# Altium project hw_design.PrjPcb (part 3 of 5)

## Sheet comms_vhf.SchDoc
size A4; SheetNumber: 3; SheetTotal: 5
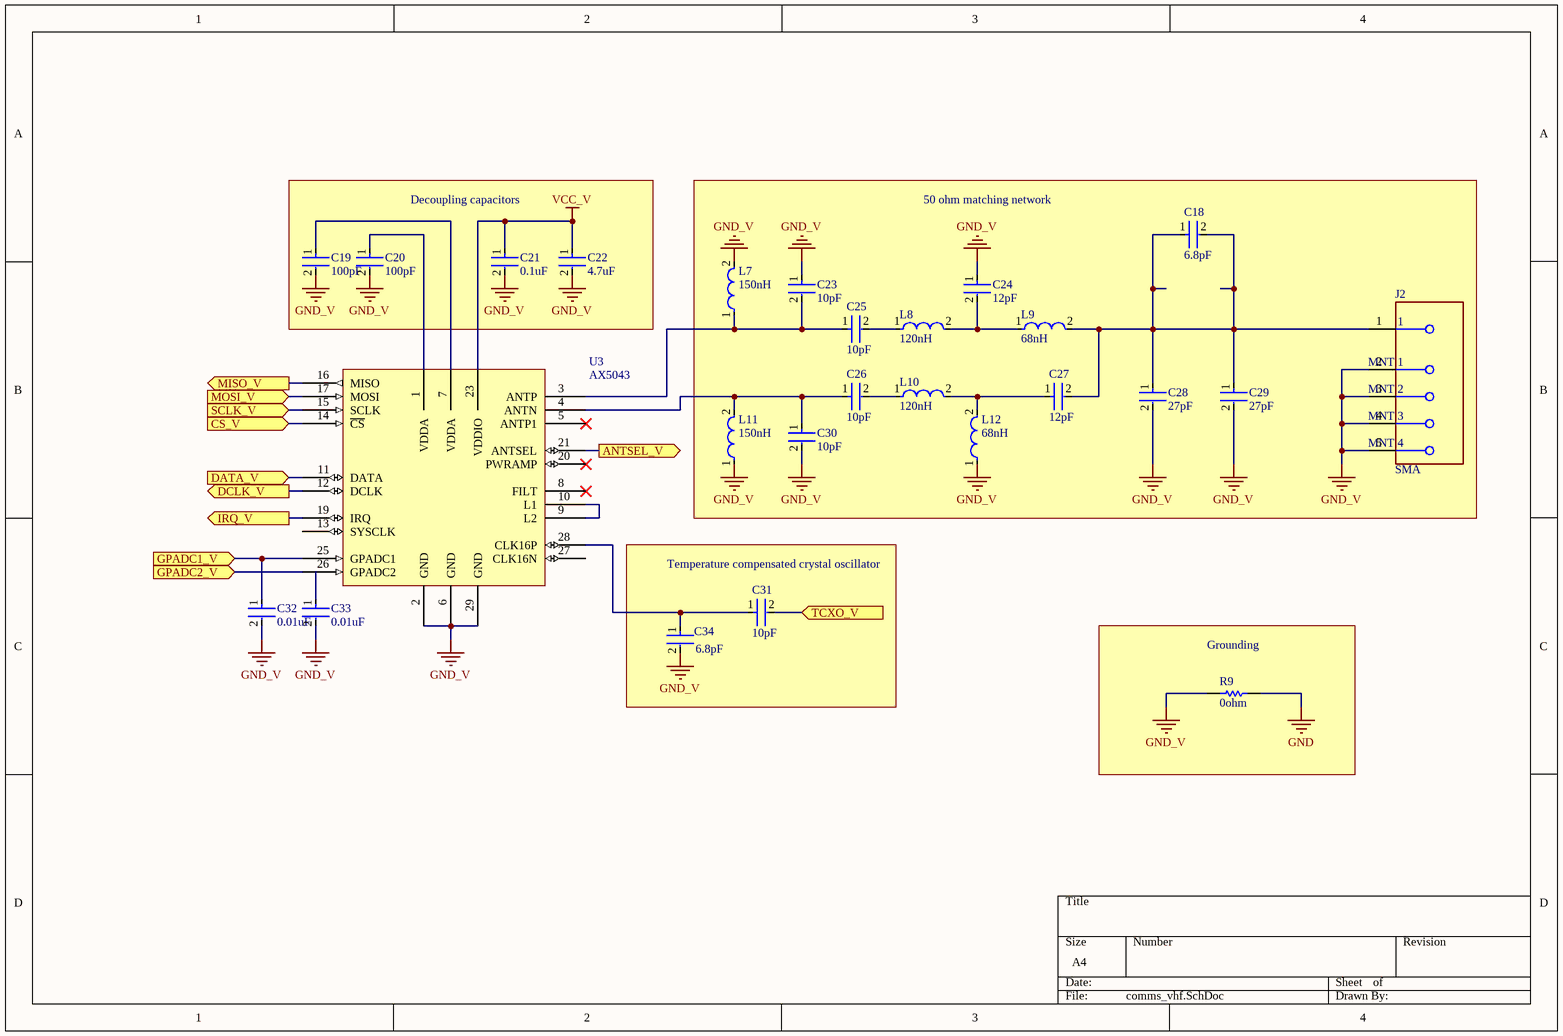
[diagram p2: comms_vhf.SchDoc]

### Parts
C18  6.8pF  [FP-C0805C-DN-IPC_A]
C19  100pF  [FP-C0805C-DN-IPC_A]
C20  100pF  [FP-C0805C-DN-IPC_A]
C21  0.1uF  [FP-C0805C-DN-IPC_A]
C22  4.7uF  [FP-C0805C-DN-IPC_A]
C23  10pF  [FP-C0805C-DN-IPC_A]
C24  12pF  [FP-C0805C-DN-IPC_A]
C25  10pF  [FP-C0805C-DN-IPC_A]
C26  10pF  [FP-C0805C-DN-IPC_A]
C27  12pF  [FP-C0805C-DN-IPC_A]
C28  27pF  [FP-C0805C-DN-IPC_A]
C29  27pF  [FP-C0805C-DN-IPC_A]
C30  10pF  [FP-C0805C-DN-IPC_A]
C31  10pF  [FP-C0805C-DN-IPC_A]
C32  0.01uF  [FP-C0805C-DN-IPC_A]
C33  0.01uF  [FP-C0805C-DN-IPC_A]
C34  6.8pF  [FP-C0805C-DN-IPC_A]
J2  SMA  [FP-73251-1350-MFG]
L7  150nH  [FP-C0805C-DN-IPC_A]
L8  120nH  [FP-C0805C-DN-IPC_A]
L9  68nH  [FP-C0805C-DN-IPC_A]
L10  120nH  [FP-C0805C-DN-IPC_A]
L11  150nH  [FP-C0805C-DN-IPC_A]
L12  68nH  [FP-C0805C-DN-IPC_A]
R9  0ohm  [FP-C0805C-DN-IPC_A]
U3  AX5043  [QFN50P500X500X90_HS-29N]

### Blocks framed on the sheet
Decoupling capacitors: C19-C22
50 ohm matching network: C18 C23-C30 J2 L7-L12
Temperature compensated crystal oscillator: C31 C34
Grounding: R9

### Ports
ANTSEL_V (out), CS_V (in), DATA_V (in), DCLK_V (out), GPADC1_V (in), GPADC2_V (in), IRQ_V (out), MISO_V (out), MOSI_V (in), SCLK_V (in), TCXO_V (in)

### Nets
GND: R9.2
GND_V: C19.2 C20.2 C21.2 C22.2 C23.1 C24.1 C28.2 C29.2 C30.2 C32.2 C33.2 C34.2 J2.2(MNT_1) J2.3(MNT_2) J2.4(MNT_3) J2.5(MNT_4) L7.2 L11.1 L12.1 R9.1 U3.2(GND) U3.6(GND) U3.29(GND)
VCC_V: C21.1 C22.1 U3.23(VDDIO)
ANTSEL_V: U3.21(ANTSEL) ; port ANTSEL_V
CS_V: U3.14(~{CS}) ; port CS_V
DATA_V: U3.11(DATA) ; port DATA_V
DCLK_V: U3.12(DCLK) ; port DCLK_V
GPADC1_V: C32.1 U3.25(GPADC1) ; port GPADC1_V
GPADC2_V: U3.26(GPADC2) ; port GPADC2_V
IRQ_V: U3.19(IRQ) ; port IRQ_V
MISO_V: U3.16(MISO) ; port MISO_V
MOSI_V: U3.17(MOSI) ; port MOSI_V
SCLK_V: U3.15(SCLK) ; port SCLK_V
TCXO_V: C31.2 ; port TCXO_V
NetC18_1: C18.1 C18.2 C27.2 C28.1 C29.1 J2.1 L9.2
NetC19_1: C19.1 U3.7(VDDA)
NetC20_1: C20.1 U3.1(VDDA)
NetC23_2: C23.2 C25.1 L7.1 U3.3(ANTP)
NetC24_2: C24.2 L8.2 L9.1
NetC25_2: C25.2 L8.1
NetC26_1: C26.1 C30.1 L11.2 U3.4(ANTN)
NetC26_2: C26.2 L10.1
NetC27_1: C27.1 L10.2 L12.2
NetC31_1: C31.1 C34.1 U3.28(CLK16P)
NetU3_9: U3.9(L2) U3.10(L1)

Not connected (* = marked no-connect by the designer): C33 1; U3 5(ANTP1)* 8(FILT)* 13(SYSCLK) 20(PWRAMP)* 27(CLK16N)

### Library data of the parts
C18 C34 = C0805C689D5GACTU: Cap Ceramic 6.8pF 50V C0G 0.5pF SMD 0805 125°C Plastic T/R; Manufacturer: KEMET; Dissipation Factor: 0.1%; Supplier 1: Digi-Key; Manufacturer Part Number: C0805C689D5GACTU; RoHS: Yes; Category: Ceramic Capacitors; Stock 1: 43898; Pricing 1: 1=0.24000, 10=0.16500, 50=0.11000, 100=0.09350, 500=0.06600, 1000=0.05775 (USD); Mount: Surface Mount; Case/Package: 0805; Case Code (Metric): 2012; Case Code (Imperial): 0805; Dielectric Material: Ceramic; Contact Material: Tin; Min Operating Temperature: -55°C; Max Operating Temperature: 125°C; Package Quantity: 1; Capacitance: 6.8pF; Voltage Rating: 50V; Packaging: Tape and Reel; Voltage Rating (DC): 50V; Termination: SMD/SMT; Series: C; Dielectric: C0G; Construction: Flat; Length: 2mm; Width: 0.049inch; Height: 0.78mm; Thickness: 0.035inch; Depth: 1.25mm; Lead Pitch: 0.75mm; Radiation Hardening: No; RoHS Compliant: Yes; Lead Free: Lead Free; REACH SVHC: No SVHC; ComponentLink1URL: https://www.distrelec.biz/Web/Downloads/_t/ds/KEM_C1003_C0G_SMD_eng_tds.pdf?mime=application%2Fpdf&src-supplier=Distrelec; ComponentLink1Description: https://www.distrelec.biz/Web/Downloads/_t/ds/KEM_C1003_C0G_SMD_eng_tds.pdf?mime=application%2Fpdf&src-supplier=Distrelec; ComponentLink2URL: http://www.farnell.com/datasheets/2330629.pdf?src-supplier=Farnell; ComponentLink2Description: http://www.farnell.com/datasheets/2330629.pdf?src-supplier=Farnell; ComponentLink3URL: http://www.mouser.com/ds/2/212/KEM_C1003_C0G_SMD-1101588.pdf?src-supplier=Mouser; ComponentLink3Description: http://www.mouser.com/ds/2/212/KEM_C1003_C0G_SMD-1101588.pdf?src-supplier=Mouser; ComponentLink4URL: http://www.farnell.com/datasheets/2330629.pdf?src-supplier=Newark; ComponentLink4Description: http://www.farnell.com/datasheets/2330629.pdf?src-supplier=Newark; ComponentLink5URL: https://api.kemet.com/component-edge/download/datasheet/C0805C689D5GACTU.pdf?src-supplier=Digi-Key; ComponentLink5Description: https://api.kemet.com/component-edge/download/datasheet/C0805C689D5GACTU.pdf?src-supplier=Digi-Key; ComponentLink6URL: https://search.kemet.com/component-edge/download/datasheet/C0805C689D5GACTU.pdf?src-supplier=Digi-Key; ComponentLink6Description: https://search.kemet.com/component-edge/download/datasheet/C0805C689D5GACTU.pdf?src-supplier=Digi-Key; Supplier Part Number 1: 399-C0805C689D5GAC7800CT-ND
C19 C20 = C0805C101J1GACTU: Multilayer Ceramic Capacitors (MLCC) - SMD/SMT 100volts 100pF C0G 5%; Manufacturer: KEMET; Voltage Rating: 100V; Temperature Coefficient: 30ppm/°C; Dissipation Factor: 0.1%; Supplier 1: Digi-Key; Manufacturer Part Number: C0805C101J1GACTU; RoHS: Yes; Category: Ceramic Capacitors; Stock 1: 41207; Pricing 1: 1=0.11000, 10=0.07900, 50=0.04500, 100=0.03730, 500=0.02616, 1000=0.02166 (USD); Mount: Surface Mount,PCB; Case/Package: 0805; Number of Pins: 2; Case Code (Imperial): 0805; Case Code (Metric): 2012; Contact Plating: Tin,Matte; Dielectric Material: Ceramic; Contact Material: Tin; Min Operating Temperature: -55°C; Max Operating Temperature: 125°C; Capacitance: 100pF; Tolerance: 5%; Voltage Rating (DC): 100V; Packaging: Tape and Reel; Dielectric: C0G; Series: C; Package Quantity: 1; Termination: SMD/SMT; Voltage: 100V; Construction: Flat; Length: 2mm; Width: 1.2mm; Height: 0.78mm; Thickness: 0.035inch; Depth: 1.25mm; Lead Pitch: 0.75mm; Radiation Hardening: No; Lead Free: Lead Free; RoHS Compliant: Yes; REACH SVHC: No SVHC; ComponentLink1URL: https://datasheet.ciiva.com/144/docfinderpartnumber-c0805c101j1gactu-144890.pdf?src-supplier=Digi-Key; ComponentLink1Description: https://datasheet.ciiva.com/144/docfinderpartnumber-c0805c101j1gactu-144890.pdf?src-supplier=Digi-Key; ComponentLink2URL: https://datasheet.ciiva.com/6126/f9080b-0402-series-c0g-6126695.pdf?src-supplier=Farnell; ComponentLink2Description: https://datasheet.ciiva.com/6126/f9080b-0402-series-c0g-6126695.pdf?src-supplier=Farnell; ComponentLink3URL: https://datasheet.ciiva.com/2988/kem-c1003-c0g-smd-2988557.pdf?src-supplier=Avnet; ComponentLink3Description: https://datasheet.ciiva.com/2988/kem-c1003-c0g-smd-2988557.pdf?src-supplier=Avnet; ComponentLink4URL: https://datasheet.ciiva.com/2988/kem-c1003-c0g-smd-2988558.pdf?src-supplier=Avnet; ComponentLink4Description: https://datasheet.ciiva.com/2988/kem-c1003-c0g-smd-2988558.pdf?src-supplier=Avnet; ComponentLink5URL: https://datasheet.ciiva.com/14589/70095383-14589484.pdf?src-supplier=Allied+Electronics; ComponentLink5Description: https://datasheet.ciiva.com/14589/70095383-14589484.pdf?src-supplier=Allied+Electronics; ComponentLink6URL: https://datasheet.ciiva.com/14591/70095383-14591851.pdf?src-supplier=Allied+Electronics; ComponentLink6Description: https://datasheet.ciiva.com/14591/70095383-14591851.pdf?src-supplier=Allied+Electronics; ComponentLink7URL: https://datasheet.ciiva.com/7842/40889-7842143.pdf?src-supplier=Element14; ComponentLink7Description: https://datasheet.ciiva.com/7842/40889-7842143.pdf?src-supplier=Element14; ComponentLink8URL: https://datasheet.ciiva.com/28688/1789732-28688663.pdf?src-supplier=Element14; ComponentLink8Description: https://datasheet.ciiva.com/28688/1789732-28688663.pdf?src-supplier=Element14; ComponentLink9URL: https://datasheet.ciiva.com/18193/getdatasheetpartid-93983-18193285.pdf?src-supplier=Verical; ComponentLink9Description: https://datasheet.ciiva.com/18193/getdatasheetpartid-93983-18193285.pdf?src-supplier=Verical; ComponentLink10URL: https://datasheet.ciiva.com/7405/1372242-7405224.pdf?src-supplier=Newark; ComponentLink10Description: https://datasheet.ciiva.com/7405/1372242-7405224.pdf?src-supplier=Newark; Supplier Part Number 1: 399-C0805C101J1GAC7800CT-ND
C21 = C0805C104K5RACTU: Cap Ceramic 0.1uF 50V X7R 10% SMD 2.0 x 1.2 mm 125 C Paper T/R; Manufacturer: KEMET; Capacitance: 100nF; Voltage: 500V; Supplier 1: Digi-Key; Manufacturer Part Number: C0805C104K5RACTU; RoHS: Yes; Category: Ceramic Capacitors; Pricing 1: 1=0.15000, 10=0.10500, 50=0.05960, 100=0.04940, 500=0.03466, 1000=0.02869 (USD); Mount: Surface Mount,PCB; Case/Package: 0805; Number of Pins: 2; Case Code (Imperial): 0805; Case Code (Metric): 2012; Dielectric Material: Ceramic; Contact Plating: Tin,Matte; Min Operating Temperature: -55°C; Max Operating Temperature: 125°C; Package Quantity: 4000; Voltage Rating: 50V; Tolerance: 10%; Packaging: Tape and Reel; Dielectric: X7R; Termination: SMD/SMT; Voltage Rating (DC): 50V; Series: C0805C; Construction: Flat; Length: 2mm; Width: 1.2mm; Height: 0.9mm; Thickness: 0.035inch; Depth: 1.25mm; Lead Pitch: 0.75mm; Radiation Hardening: No; REACH SVHC: No SVHC; RoHS Compliant: Yes; ComponentLink1URL: https://www.distrelec.biz/Web/Downloads/_t/ds/KEM_C1002_X7R_SMD_eng_tds.pdf?mime=application%2Fpdf&src-supplier=Distrelec; ComponentLink1Description: https://www.distrelec.biz/Web/Downloads/_t/ds/KEM_C1002_X7R_SMD_eng_tds.pdf?mime=application%2Fpdf&src-supplier=Distrelec; ComponentLink2URL: http://www.farnell.com/datasheets/2740684.pdf?src-supplier=Farnell; ComponentLink2Description: http://www.farnell.com/datasheets/2740684.pdf?src-supplier=Farnell; ComponentLink3URL: http://www.farnell.com/datasheets/2740684.pdf?src-supplier=Element14; ComponentLink3Description: http://www.farnell.com/datasheets/2740684.pdf?src-supplier=Element14; Supplier Part Number 1: 399-C0805C104K5RAC7800CT-ND; Stock 1: 2034176
C22 = C0805C475K3PACTU: Cap Ceramic 4.7uF 25V X5R 10% SMD 0805 85°C Plastic T/R; Manufacturer: KEMET; Dissipation Factor: 5%; Supplier 1: Digi-Key; Manufacturer Part Number: C0805C475K3PACTU; RoHS: Yes; Category: Ceramic Capacitors; Pricing 1: 1=0.36000, 10=0.24800, 50=0.16500, 100=0.14020, 500=0.09900, 1000=0.08662 (USD); Mount: PCB,Surface Mount; Case/Package: 0805; Number of Pins: 2; Case Code (Imperial): 0805; Case Code (Metric): 2012; Dielectric Material: Ceramic; Contact Plating: Tin,Matte; Min Operating Temperature: -55°C; Max Operating Temperature: 85°C; Capacitance: 4.7uF; Tolerance: 10%; Packaging: Tape and Reel; Dielectric: X5R; Package Quantity: 2500; Series: C0805C; Termination: SMD/SMT; Voltage Rating (DC): 25V; Construction: Flat; Voltage: 25V; Length: 2mm; Width: 1.2mm; Height: 1.25mm; Depth: 1.25mm; Radiation Hardening: No; RoHS Compliant: Yes; Lead Free: Lead Free; REACH SVHC: No SVHC; ComponentLink1URL: https://datasheet.ciiva.com/3776/c0603c102k5racturegion-naregion-na-3776917.pdf?src-supplier=Arrow+Electronics; ComponentLink1Description: https://datasheet.ciiva.com/3776/c0603c102k5racturegion-naregion-na-3776917.pdf?src-supplier=Arrow+Electronics; ComponentLink2URL: https://datasheet.ciiva.com/18193/getdatasheetpartid-385757-18193895.pdf?src-supplier=Verical; ComponentLink2Description: https://datasheet.ciiva.com/18193/getdatasheetpartid-385757-18193895.pdf?src-supplier=Verical; ComponentLink3URL: https://datasheet.ciiva.com/18193/getdatasheetpartid-195812-18193898.pdf?src-supplier=Verical; ComponentLink3Description: https://datasheet.ciiva.com/18193/getdatasheetpartid-195812-18193898.pdf?src-supplier=Verical; ComponentLink4URL: https://datasheet.ciiva.com/7842/40889-7842614.pdf?src-supplier=Element14; ComponentLink4Description: https://datasheet.ciiva.com/7842/40889-7842614.pdf?src-supplier=Element14; ComponentLink5URL: https://datasheet.ciiva.com/22748/1918694-22748309.pdf?src-supplier=Element14; ComponentLink5Description: https://datasheet.ciiva.com/22748/1918694-22748309.pdf?src-supplier=Element14; Supplier Part Number 1: 399-C0805C475K3PAC7800CT-ND; Stock 1: 10860
C23 C25 C26 C30 C31 = C0805C100J1GACTU: Cap Ceramic 10pF 100V C0G 5% SMD 0805 125C Plastic T/R; Manufacturer: KEMET; Dissipation Factor: 0.1%; Temperature Coefficient: 30ppm/°C; Supplier 1: Digi-Key; Manufacturer Part Number: C0805C100J1GACTU; RoHS: Yes; Category: Ceramic Capacitors; Stock 1: 26087; Pricing 1: 1=0.20000, 10=0.14000, 50=0.07960, 100=0.06600, 500=0.04630, 1000=0.03833 (USD); Mount: Surface Mount,PCB; Case/Package: 0805; Number of Pins: 2; Case Code (Metric): 2012; Case Code (Imperial): 0805; Dielectric Material: Ceramic; Weight: 0.000194oz; Contact Material: Tin; Min Operating Temperature: -55°C; Max Operating Temperature: 125°C; Capacitance: 10pF; Packaging: Tape and Reel; Voltage Rating: 100V; Voltage Rating (DC): 100V; Package Quantity: 1; Dielectric: C0G; Termination: SMD/SMT; Tolerance: 5%; Series: C; Construction: Flat; Voltage: 100V; Length: 2mm; Width: 0.049inch; Height: 0.78mm; Thickness: 0.035inch; Depth: 1.25mm; Radiation Hardening: No; REACH SVHC: No SVHC; RoHS Compliant: Yes; Lead Free: Lead Free; ComponentLink1URL: https://datasheet.ciiva.com/7842/kem-c1003-c0g-smd-7842137.pdf?src-supplier=Element14; ComponentLink1Description: https://datasheet.ciiva.com/7842/kem-c1003-c0g-smd-7842137.pdf?src-supplier=Element14; ComponentLink2URL: https://datasheet.ciiva.com/7842/kem-c1003-c0g-smd-7842136.pdf?src-supplier=Element14; ComponentLink2Description: https://datasheet.ciiva.com/7842/kem-c1003-c0g-smd-7842136.pdf?src-supplier=Element14; ComponentLink3URL: https://datasheet.ciiva.com/28668/1789732-28668725.pdf?src-supplier=Element14; ComponentLink3Description: https://datasheet.ciiva.com/28668/1789732-28668725.pdf?src-supplier=Element14; ComponentLink4URL: https://datasheet.ciiva.com/14588/70095383-14588189.pdf?src-supplier=Allied+Electronics; ComponentLink4Description: https://datasheet.ciiva.com/14588/70095383-14588189.pdf?src-supplier=Allied+Electronics; ComponentLink5URL: https://datasheet.ciiva.com/14603/70095383-14603133.pdf?src-supplier=Allied+Electronics; ComponentLink5Description: https://datasheet.ciiva.com/14603/70095383-14603133.pdf?src-supplier=Allied+Electronics; Supplier Part Number 1: 399-C0805C100J1GAC7800CT-ND
C24 C27 = C0805C120J5GACTU: 0805 C 12pF Ceramic Multilayer Capacitor; 50 VDC; +125degC; C0G Dielec; +/-5%; Manufacturer: KEMET; Voltage Rating: 50V; Tolerance: 5%; Temperature Coefficient: 30ppm/°C; Dissipation Factor: 0.1%; Supplier 1: Digi-Key; Manufacturer Part Number: C0805C120J5GACTU; RoHS: Yes; Category: Ceramic Capacitors; Stock 1: 165027; Pricing 1: 1=0.13000, 10=0.09300, 50=0.05260, 100=0.04350, 500=0.03054, 1000=0.02528 (USD); Mount: Surface Mount,PCB; Case/Package: 0805; Number of Pins: 2; Case Code (Metric): 2012; Case Code (Imperial): 0805; Dielectric Material: Ceramic; Contact Material: Tin; Min Operating Temperature: -55°C; Max Operating Temperature: 125°C; Capacitance: 12pF; Packaging: Tape and Reel; Voltage Rating (DC): 50V; Dielectric: C0G; Construction: Flat; Package Quantity: 1; Termination: SMD/SMT; Series: C; Voltage: 50V; Length: 2mm; Width: 0.049inch; Height: 0.78mm; Depth: 1.25mm; Thickness: 0.035inch; Lead Pitch: 0.75mm; Radiation Hardening: No; RoHS Compliant: Yes; REACH SVHC: No SVHC; Lead Free: Lead Free; ComponentLink1URL: https://datasheet.ciiva.com/6136/1732692-6136713.pdf?src-supplier=Farnell; ComponentLink1Description: https://datasheet.ciiva.com/6136/1732692-6136713.pdf?src-supplier=Farnell; ComponentLink2URL: https://datasheet.ciiva.com/144/docfinderpartnumber-c0805c120j5gactu-144980.pdf?src-supplier=Digi-Key; ComponentLink2Description: https://datasheet.ciiva.com/144/docfinderpartnumber-c0805c120j5gactu-144980.pdf?src-supplier=Digi-Key; ComponentLink3URL: https://datasheet.ciiva.com/7842/1732692-7842203.pdf?src-supplier=Element14; ComponentLink3Description: https://datasheet.ciiva.com/7842/1732692-7842203.pdf?src-supplier=Element14; ComponentLink4URL: https://datasheet.ciiva.com/7842/1732692-7842204.pdf?src-supplier=Element14; ComponentLink4Description: https://datasheet.ciiva.com/7842/1732692-7842204.pdf?src-supplier=Element14; ComponentLink5URL: https://datasheet.ciiva.com/28696/1789732-28696013.pdf?src-supplier=Element14; ComponentLink5Description: https://datasheet.ciiva.com/28696/1789732-28696013.pdf?src-supplier=Element14; ComponentLink6URL: https://datasheet.ciiva.com/14586/70095383-14586716.pdf?src-supplier=Allied+Electronics; ComponentLink6Description: https://datasheet.ciiva.com/14586/70095383-14586716.pdf?src-supplier=Allied+Electronics; ComponentLink7URL: https://datasheet.ciiva.com/5418/kem-c1003-c0g-smd-356956-5418089.pdf?src-supplier=Mouser; ComponentLink7Description: https://datasheet.ciiva.com/5418/kem-c1003-c0g-smd-356956-5418089.pdf?src-supplier=Mouser; ComponentLink8URL: https://datasheet.ciiva.com/11463/kem-c1003-c0g-smd-11463493.pdf?src-supplier=Avnet; ComponentLink8Description: https://datasheet.ciiva.com/11463/kem-c1003-c0g-smd-11463493.pdf?src-supplier=Avnet; ComponentLink9URL: https://datasheet.ciiva.com/18193/getdatasheetpartid-179336-18193526.pdf?src-supplier=Verical; ComponentLink9Description: https://datasheet.ciiva.com/18193/getdatasheetpartid-179336-18193526.pdf?src-supplier=Verical; Supplier Part Number 1: 399-C0805C120J5GAC7800CT-ND
C28 C29 = C0805C270J5GACTU: Cap Ceramic 27pF ±5% 50V C0G, NP0 0805; Manufacturer: KEMET; Temperature Coefficient: 30ppm/°C; Dissipation Factor: 0.1%; Supplier 1: Digi-Key; Manufacturer Part Number: C0805C270J5GACTU; RoHS: Yes; Category: Ceramic Capacitors; Stock 1: 95279; Pricing 1: 1=0.10000, 10=0.07600, 50=0.04160, 100=0.03400, 500=0.02426, 1000=0.01906 (USD); Mount: Surface Mount,PCB; Case/Package: 0805; Case Code (Imperial): 0805; Case Code (Metric): 2012; Dielectric Material: Ceramic; Contact Plating: Tin,Matte; Contact Material: Tin; Min Operating Temperature: -55°C; Max Operating Temperature: 125°C; Tolerance: 5%; Capacitance: 27pF; Packaging: Tape and Reel; Dielectric: C0G; Voltage Rating (DC): 50V; Voltage Rating: 50V; Termination: SMD/SMT; Package Quantity: 4000; Series: C0805C; Construction: Flat; Voltage: 50V; Length: 2mm; Width: 1.2mm; Height: 0.78mm; Depth: 1.25mm; Lead Pitch: 0.75mm; Radiation Hardening: No; RoHS Compliant: Yes; REACH SVHC: No SVHC; Lead Free: Lead Free; ComponentLink1URL: https://datasheet.ciiva.com/7842/f9080b-0402-series-c0g-7842586.pdf?src-supplier=Element14; ComponentLink1Description: https://datasheet.ciiva.com/7842/f9080b-0402-series-c0g-7842586.pdf?src-supplier=Element14; ComponentLink2URL: https://datasheet.ciiva.com/18193/getdatasheetpartid-385709-18193707.pdf?src-supplier=Verical; ComponentLink2Description: https://datasheet.ciiva.com/18193/getdatasheetpartid-385709-18193707.pdf?src-supplier=Verical; Supplier Part Number 1: 399-C0805C270J5GAC7800CT-ND
C32 C33 = C0805C103K5RAC-TU: Cap Ceramic 0.01uF 50V X7R 10% SMD 0805 125C Plastic T/R; Manufacturer: KEMET; Capacitance: 10nF; Supplier 1: RSComponents; Manufacturer Part Number: C0805C103K5RAC-TU; RoHS: Yes; Category: Ceramic Capacitors; Stock 1: 8800; Pricing 1: 25=0.14500, 100=0.13600, 250=0.12500, 500=0.11800, 1250=0.10800 (USD); Mount: PCB,Surface Mount; Case/Package: 0805; Number of Pins: 2; Case Code (Metric): 2012; Case Code (Imperial): 0805; Dielectric Material: Ceramic; Min Operating Temperature: -55°C; Max Operating Temperature: 125°C; Voltage Rating (DC): 50V; Tolerance: 10%; Voltage Rating: 50V; Packaging: Tape and Reel; Package Quantity: 4000; Dielectric: X7R; Termination: SMD/SMT; Voltage: 50V; Series: C0805C; Construction: Flat; Length: 2mm; Width: 1.2mm; Height: 0.78mm; Thickness: 0.035inch; Depth: 1.25mm; Lead Pitch: 0.75mm; Radiation Hardening: No; REACH SVHC: No SVHC; ComponentLink1URL: https://datasheet.ciiva.com/7172/1828800-7172412.pdf?src-supplier=Newark; ComponentLink1Description: https://datasheet.ciiva.com/7172/1828800-7172412.pdf?src-supplier=Newark; ComponentLink2URL: https://datasheet.ciiva.com/5904/kem-c1002-x7r-smd-5904709.pdf?src-supplier=Farnell; ComponentLink2Description: https://datasheet.ciiva.com/5904/kem-c1002-x7r-smd-5904709.pdf?src-supplier=Farnell; ComponentLink3URL: https://datasheet.ciiva.com/7842/kem-c1002-x7r-smd-7842533.pdf?src-supplier=Element14; ComponentLink3Description: https://datasheet.ciiva.com/7842/kem-c1002-x7r-smd-7842533.pdf?src-supplier=Element14; ComponentLink4URL: https://datasheet.ciiva.com/28672/1851736-28672830.pdf?src-supplier=Element14; ComponentLink4Description: https://datasheet.ciiva.com/28672/1851736-28672830.pdf?src-supplier=Element14; ComponentLink5URL: https://datasheet.ciiva.com/26923/getdatasheetpartid-759674-26923957.pdf?src-supplier=Verical; ComponentLink5Description: https://datasheet.ciiva.com/26923/getdatasheetpartid-759674-26923957.pdf?src-supplier=Verical; ComponentLink6URL: https://datasheet.ciiva.com/39122/docfinderpartnumberc0402c102k5ractu-39122923.pdf?src-supplier=Onlinecomponents.com; ComponentLink6Description: https://datasheet.ciiva.com/39122/docfinderpartnumberc0402c102k5ractu-39122923.pdf?src-supplier=Onlinecomponents.com; Supplier Part Number 1: 2644371
J2 = 73251-1350: RF Connectors / Coaxial Connectors SMA ST PCB-JCK STD SMT; Manufacturer: Molex; Body Material: Brass; Body Plating: Gold; Impedance: 50R; Connector Type: SMA,Coaxial; Gender: Female; Supplier 1: Digi-Key; Manufacturer Part Number: 73251-1350; RoHS: Yes; Category: RF / Coaxial Connectors; Pricing 1: 1=3.73000, 10=3.28200, 80=2.61025, 1600=2.08824 (USD); Case/Package: SMA; Contact Material: Copper; Contact Plating: Gold; Insulation Material: Teflon; Packaging: Tray; Termination: Solder; Package Quantity: 1600; Series: 73251; Orientation: Straight; Length: 6.35mm; Depth: 6.35mm; Radiation Hardening: No; RoHS Compliant: Yes; REACH SVHC: Unknown; Halogen Free: Low Halogen; ComponentLink1URL: https://datasheet.ciiva.com/22652/1443748-22652884.pdf?src-supplier=Element14; ComponentLink1Description: https://datasheet.ciiva.com/22652/1443748-22652884.pdf?src-supplier=Element14; ComponentLink2URL: https://datasheet.ciiva.com/5718/1716114-5718582.pdf?src-supplier=Farnell; ComponentLink2Description: https://datasheet.ciiva.com/5718/1716114-5718582.pdf?src-supplier=Farnell; ComponentLink3URL: https://datasheet.ciiva.com/7996/1818909-7996462.pdf?src-supplier=Element14; ComponentLink3Description: https://datasheet.ciiva.com/7996/1818909-7996462.pdf?src-supplier=Element14; ComponentLink4URL: https://datasheet.ciiva.com/23673/1763868-23673641.pdf?src-supplier=Newark; ComponentLink4Description: https://datasheet.ciiva.com/23673/1763868-23673641.pdf?src-supplier=Newark; ComponentLink5URL: https://datasheet.ciiva.com/15226/getdatasheetpartid-152891-15226055.pdf?src-supplier=Verical; ComponentLink5Description: https://datasheet.ciiva.com/15226/getdatasheetpartid-152891-15226055.pdf?src-supplier=Verical; Supplier Part Number 1: WM9357-ND
L7 L11 = LQW2BASR15J00L: Ind RF Chip Wirewound 150nH 5% 100MHz 50Q-Factor 400mA 0805 Embossed T/R; Manufacturer: Murata; Core Material: Air; Shielding: Unshielded; Self Resonant Frequency: 920MHz; DC Resistance (DCR): 560mR; Q Factor: 50; Supplier 1: Digi-Key; Manufacturer Part Number: LQW2BASR15J00L; RoHS: Yes; Category: Fixed Inductors; Stock 1: 10064; Pricing 1: 1=0.25000, 10=0.22800, 25=0.20240, 50=0.17200, 100=0.15180, 250=0.13916, 500=0.12650, 1000=0.10626 (USD); Mount: Surface Mount; Case/Package: 0805; Case Code (Metric): 2015; Case Code (Imperial): 0806; Weight: 0.000494oz; Min Operating Temperature: -55°C; Max Operating Temperature: 125°C; Tolerance: 5%; Packaging: Tape and Reel; Inductance: 150nH; Package Quantity: 2000; Current Rating: 400mA; Test Frequency: 100MHz; Max DC Current: 400mA; Series: LQW2BA; Termination: SMD/SMT; Resistor Type: Wirewound; DC Current: 400mA; Length: 0.082inch; Width: 0.06inch; Height: 1.42mm; Height - Seated (Max): 0.06inch; Depth: 1.73mm; Radiation Hardening: No; RoHS Compliant: Yes; Military Standard: Not; ComponentLink1URL: https://datasheet.ciiva.com/1056/l0075s0080lqw2ba-1056256.pdf?src-supplier=Digi-Key; ComponentLink1Description: https://datasheet.ciiva.com/1056/l0075s0080lqw2ba-1056256.pdf?src-supplier=Digi-Key; ComponentLink2URL: https://datasheet.ciiva.com/1056/l0075s0080lqw2ba-1056257.pdf?src-supplier=Digi-Key; ComponentLink2Description: https://datasheet.ciiva.com/1056/l0075s0080lqw2ba-1056257.pdf?src-supplier=Digi-Key; ComponentLink3URL: https://datasheet.ciiva.com/1056/l0075s0080lqw2ba-1056258.pdf?src-supplier=Digi-Key; ComponentLink3Description: https://datasheet.ciiva.com/1056/l0075s0080lqw2ba-1056258.pdf?src-supplier=Digi-Key; ComponentLink4URL: https://datasheet.ciiva.com/3080/l0075s0080lqw2ba-3080336.pdf?src-supplier=Avnet; ComponentLink4Description: https://datasheet.ciiva.com/3080/l0075s0080lqw2ba-3080336.pdf?src-supplier=Avnet; Supplier Part Number 1: 490-5667-1-ND
L8 L10 = LQW2BHNR12J03L: Inductor RF Chip Wirewound 120nH 5% 100MHz 40Q-Factor Air 320mA 400mOhm DCR 0805 Embossed T/R; Manufacturer: Murata; Core Material: Non-Magnetic,Air; Self Resonant Frequency: 750MHz; DC Resistance (DCR): 400mR; Q Factor: 40; Shielding: Unshielded; Supplier 1: Digi-Key; Manufacturer Part Number: LQW2BHNR12J03L; RoHS: Yes; Category: Fixed Inductors; Stock 1: 2009; Pricing 1: 1=0.48000, 10=0.42900, 25=0.37520, 50=0.32180, 100=0.29490, 250=0.26812, 500=0.25204, 1000=0.19305 (USD); Mount: Surface Mount; Case/Package: 0805; Case Code (Metric): 2012; Case Code (Imperial): 0805; Weight: 0.000317oz; Min Operating Temperature: -55°C; Max Operating Temperature: 85°C; Packaging: Tape and Reel; Tolerance: 5%; Inductance: 120nH; Package Quantity: 2000; Max DC Current: 320mA; Test Frequency: 100MHz; Termination: SMD/SMT; Series: LQW2BHN_03; Current Rating: 320mA; Resistor Type: Wirewound; DC Current: 320mA; Length: 0.079inch; Width: 1.5mm; Height: 1.7mm; Depth: 1.7mm; Height - Seated (Max): 0.07inch; Radiation Hardening: No; RoHS Compliant: Yes; Military Standard: Not; ComponentLink1URL: https://datasheet.ciiva.com/11801/0900766b80f155f9-11801532.pdf?src-supplier=RSComponents; ComponentLink1Description: https://datasheet.ciiva.com/11801/0900766b80f155f9-11801532.pdf?src-supplier=RSComponents; ComponentLink2URL: https://datasheet.ciiva.com/29691/o05e-29691995.pdf?src-supplier=Digi-Key; ComponentLink2Description: https://datasheet.ciiva.com/29691/o05e-29691995.pdf?src-supplier=Digi-Key; ComponentLink3URL: https://datasheet.ciiva.com/8508/l0075s0081lqw2bh-03-8508453.pdf?src-supplier=Avnet; ComponentLink3Description: https://datasheet.ciiva.com/8508/l0075s0081lqw2bh-03-8508453.pdf?src-supplier=Avnet; Supplier Part Number 1: 490-11792-1-ND
L9 L12 = LQW2BAS68NJ00L: Ind RF Chip Wirewound 68nH 5% 200MHz 60Q-Factor 500mA 0805 Embossed T/R; Manufacturer: Murata; Core Material: Air,Non-Magnetic; Self Resonant Frequency: 1.5GHz; DC Resistance (DCR): 380mR; Q Factor: 60; Shielding: Unshielded; Supplier 1: Digi-Key; Manufacturer Part Number: LQW2BAS68NJ00L; RoHS: Yes; Category: Fixed Inductors; Stock 1: 1897; Pricing 1: 1=0.25000, 10=0.22800, 25=0.20240, 50=0.17200, 100=0.15180, 250=0.13916, 500=0.12650, 1000=0.10626 (USD); Mount: Surface Mount; Case/Package: 0805; Case Code (Metric): 2015; Case Code (Imperial): 0805; Weight: 0.000494oz; Min Operating Temperature: -55°C; Max Operating Temperature: 125°C; Packaging: Tape and Reel; Inductance: 68nH; Test Frequency: 200MHz; Max DC Current: 500mA; Series: LQW; Tolerance: 5%; Package Quantity: 2000; Current Rating: 500mA; Termination: SMD/SMT; Resistor Type: Wirewound; DC Current: 500mA; Length: 0.082inch; Width: 0.06inch; Height: 1.42mm; Depth: 1.73mm; Height - Seated (Max): 0.06inch; Radiation Hardening: No; RoHS Compliant: Yes; Military Standard: Not; Lead Free: Lead Free; ComponentLink1URL: https://datasheet.ciiva.com/1044/l0075s0080lqw2ba-1044766.pdf?src-supplier=Digi-Key; ComponentLink1Description: https://datasheet.ciiva.com/1044/l0075s0080lqw2ba-1044766.pdf?src-supplier=Digi-Key; ComponentLink2URL: https://datasheet.ciiva.com/1044/l0075s0080lqw2ba-1044767.pdf?src-supplier=Digi-Key; ComponentLink2Description: https://datasheet.ciiva.com/1044/l0075s0080lqw2ba-1044767.pdf?src-supplier=Digi-Key; ComponentLink3URL: https://datasheet.ciiva.com/1044/l0075s0080lqw2ba-1044768.pdf?src-supplier=Digi-Key; ComponentLink3Description: https://datasheet.ciiva.com/1044/l0075s0080lqw2ba-1044768.pdf?src-supplier=Digi-Key; ComponentLink4URL: https://datasheet.ciiva.com/3080/l0075s0080lqw2ba-3080327.pdf?src-supplier=Avnet; ComponentLink4Description: https://datasheet.ciiva.com/3080/l0075s0080lqw2ba-3080327.pdf?src-supplier=Avnet; ComponentLink5URL: https://datasheet.ciiva.com/16448/l0075s0080lqw2ba-16448937.pdf?src-supplier=Future+Electronics; ComponentLink5Description: https://datasheet.ciiva.com/16448/l0075s0080lqw2ba-16448937.pdf?src-supplier=Future+Electronics; Supplier Part Number 1: 490-5661-1-ND
R9 = CRCW08050000Z0EA: CRCW Series 0805 0.125 W 0 Ohm Jumper Surface Mount Thick Film Chip Resistor; Manufacturer: Vishay; Power Rating: 125mW; Temperature Coefficient: 100ppm/°C; Voltage Rating: 150V; Tolerance: 1%; Resistance: 0mR; Supplier 1: Digi-Key; Manufacturer Part Number: CRCW08050000Z0EA; RoHS: Yes; Category: Chip SMD Resistors; Pricing 1: 1=0.10000, 10=0.04400, 25=0.03160, 50=0.02400, 100=0.01770, 250=0.01352, 500=0.01080, 1000=0.00795 (USD); Case/Package: 0805; Case Code (Imperial): 0805; Case Code (Metric): 2012; Contact Plating: Tin,Lead; Size Code: 0805; Weight: 0.000194oz; Min Operating Temperature: -55°C; Max Operating Temperature: 155°C; Packaging: Tape and Reel; Resistor Type: Thick Film; Series: CRCW; Termination: SMD/SMT; Package Quantity: 1; Number of Terminations: 2; Max Power Dissipation: 125mW; Construction: Rectangular; Voltage Rating (DC): 150V; Features: Automotive AEC-Q200; Technology: THICK FILM; Resistance Tolerance: 1%; Length: 2mm; Width: 1.25mm; Height: 0.45mm; Depth: 1.25mm; Radiation Hardening: No; RoHS Compliant: Yes; REACH SVHC: Unknown; Lead Free: Lead Free; Military Standard: Not; ComponentLink1URL: https://datasheet.ciiva.com/11811/0900766b80d98b26-11811304.pdf?src-supplier=RSComponents; ComponentLink1Description: https://datasheet.ciiva.com/11811/0900766b80d98b26-11811304.pdf?src-supplier=RSComponents; ComponentLink2URL: https://datasheet.ciiva.com/2463/dcrcwe3-2463037.pdf?src-supplier=Digi-Key; ComponentLink2Description: https://datasheet.ciiva.com/2463/dcrcwe3-2463037.pdf?src-supplier=Digi-Key; ComponentLink3URL: https://datasheet.ciiva.com/2463/dcrcwe3-2463038.pdf?src-supplier=Digi-Key; ComponentLink3Description: https://datasheet.ciiva.com/2463/dcrcwe3-2463038.pdf?src-supplier=Digi-Key; ComponentLink4URL: https://datasheet.ciiva.com/2463/dcrcwe3-2463039.pdf?src-supplier=Digi-Key; ComponentLink4Description: https://datasheet.ciiva.com/2463/dcrcwe3-2463039.pdf?src-supplier=Digi-Key; ComponentLink5URL: https://datasheet.ciiva.com/5543/dcrcwe3-109170-5543096.pdf?src-supplier=Mouser; ComponentLink5Description: https://datasheet.ciiva.com/5543/dcrcwe3-109170-5543096.pdf?src-supplier=Mouser; ComponentLink6URL: https://datasheet.ciiva.com/16389/dcrcwe3-16389338.pdf?src-supplier=Future+Electronics; ComponentLink6Description: https://datasheet.ciiva.com/16389/dcrcwe3-16389338.pdf?src-supplier=Future+Electronics; ComponentLink7URL: https://datasheet.ciiva.com/7841/1697337-7841629.pdf?src-supplier=Element14; ComponentLink7Description: https://datasheet.ciiva.com/7841/1697337-7841629.pdf?src-supplier=Element14; ComponentLink8URL: https://datasheet.ciiva.com/7841/1720486-7841839.pdf?src-supplier=Element14; ComponentLink8Description: https://datasheet.ciiva.com/7841/1720486-7841839.pdf?src-supplier=Element14; ComponentLink9URL: https://datasheet.ciiva.com/26314/fld-crcw-e3-data-en-26314630.pdf?src-supplier=Distrelec; ComponentLink9Description: https://datasheet.ciiva.com/26314/fld-crcw-e3-data-en-26314630.pdf?src-supplier=Distrelec; ComponentLink10URL: https://datasheet.ciiva.com/16719/70201119-16719706.pdf?src-supplier=Allied+Electronics; ComponentLink10Description: https://datasheet.ciiva.com/16719/70201119-16719706.pdf?src-supplier=Allied+Electronics; Supplier Part Number 1: 541-0.0ADKR-ND
U3 = AX5043-1-TW30: Rf Transceiver ASK/AFSK/FM/FSK/4-FSK/GFSK/GMSK/MSK/PSK 1.8 V to 3.6V 28-PIN QFN T/r; Manufacturer: ON Semiconductor; Frequency: 27MHz; Data Rate: 125Kbps; Sensitivity: -137dBm; Interface: SPI,UART; Current - Receiving: 11mA; Current - Transmitting: 48mA; Supplier 1: Digi-Key; Manufacturer Part Number: AX5043-1-TW30; RoHS: Yes; Category: RF Receivers, Transceivers; Stock 1: 4719; Pricing 1: 1=3.22000, 10=2.87800, 25=2.59040, 100=2.36020, 250=2.12992, 500=2.01478 (USD); Mount: Surface Mount; Case/Package: QFN; Number of Pins: 28; Contact Plating: Gold; Min Operating Temperature: -40°C; Max Operating Temperature: 85°C; Packaging: Tape and Reel; Operating Supply Voltage: 3.6V; Lead Free: Lead Free; ComponentLink1URL: http://www.mouser.com/ds/2/308/AX5043-D-782042.pdf?src-supplier=Mouser; ComponentLink1Description: http://www.mouser.com/ds/2/308/AX5043-D-782042.pdf?src-supplier=Mouser; ComponentLink2URL: http://www.farnell.com/datasheets/2354976.pdf?src-supplier=Farnell; ComponentLink2Description: http://www.farnell.com/datasheets/2354976.pdf?src-supplier=Farnell; ComponentLink3URL: http://www.onsemi.com/pub_link/Collateral/AX5043-D.PDF?src-supplier=Digi-Key; ComponentLink3Description: http://www.onsemi.com/pub_link/Collateral/AX5043-D.PDF?src-supplier=Digi-Key; ComponentLink4URL: http://www.farnell.com/datasheets/2354976.pdf?src-supplier=Newark; ComponentLink4Description: http://www.farnell.com/datasheets/2354976.pdf?src-supplier=Newark; Supplier Part Number 1: AX5043-1-TW30OSCT-ND